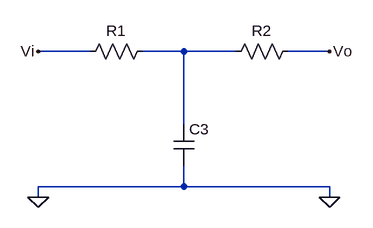
[diagram p0: schematic first_quadrupole.asc]
first_quadrupole.asc, the LTspice schematic file:
Version 4
SHEET 1 880 680
WIRE 80 112 0 112
WIRE 224 112 160 112
WIRE 304 112 224 112
WIRE 448 112 384 112
WIRE 224 224 224 112
WIRE 224 320 224 288
WIRE 224 320 0 320
WIRE 448 320 224 320
WIRE 0 336 0 320
WIRE 448 336 448 320
FLAG 0 336 0
FLAG 448 336 0
FLAG 0 112 Vi
FLAG 448 112 Vo
SYMBOL res 176 96 R90
WINDOW 0 0 56 VBottom 2
WINDOW 3 32 56 VTop 2
SYMATTR InstName R1
SYMATTR Value ""
SYMBOL res 400 96 R90
WINDOW 0 0 56 VBottom 2
WINDOW 3 32 56 VTop 2
SYMATTR InstName R2
SYMATTR Value ""
SYMBOL cap 208 224 R0
SYMATTR InstName C3
SYMATTR Value ""

The netlist it stands for:
* first_quadrupole.asc
R1 N001 Vi
R2 Vo N001
C3 N001 0
.backanno
.end